# EasyEDA Pro project pcb.epro

# Board PCB1
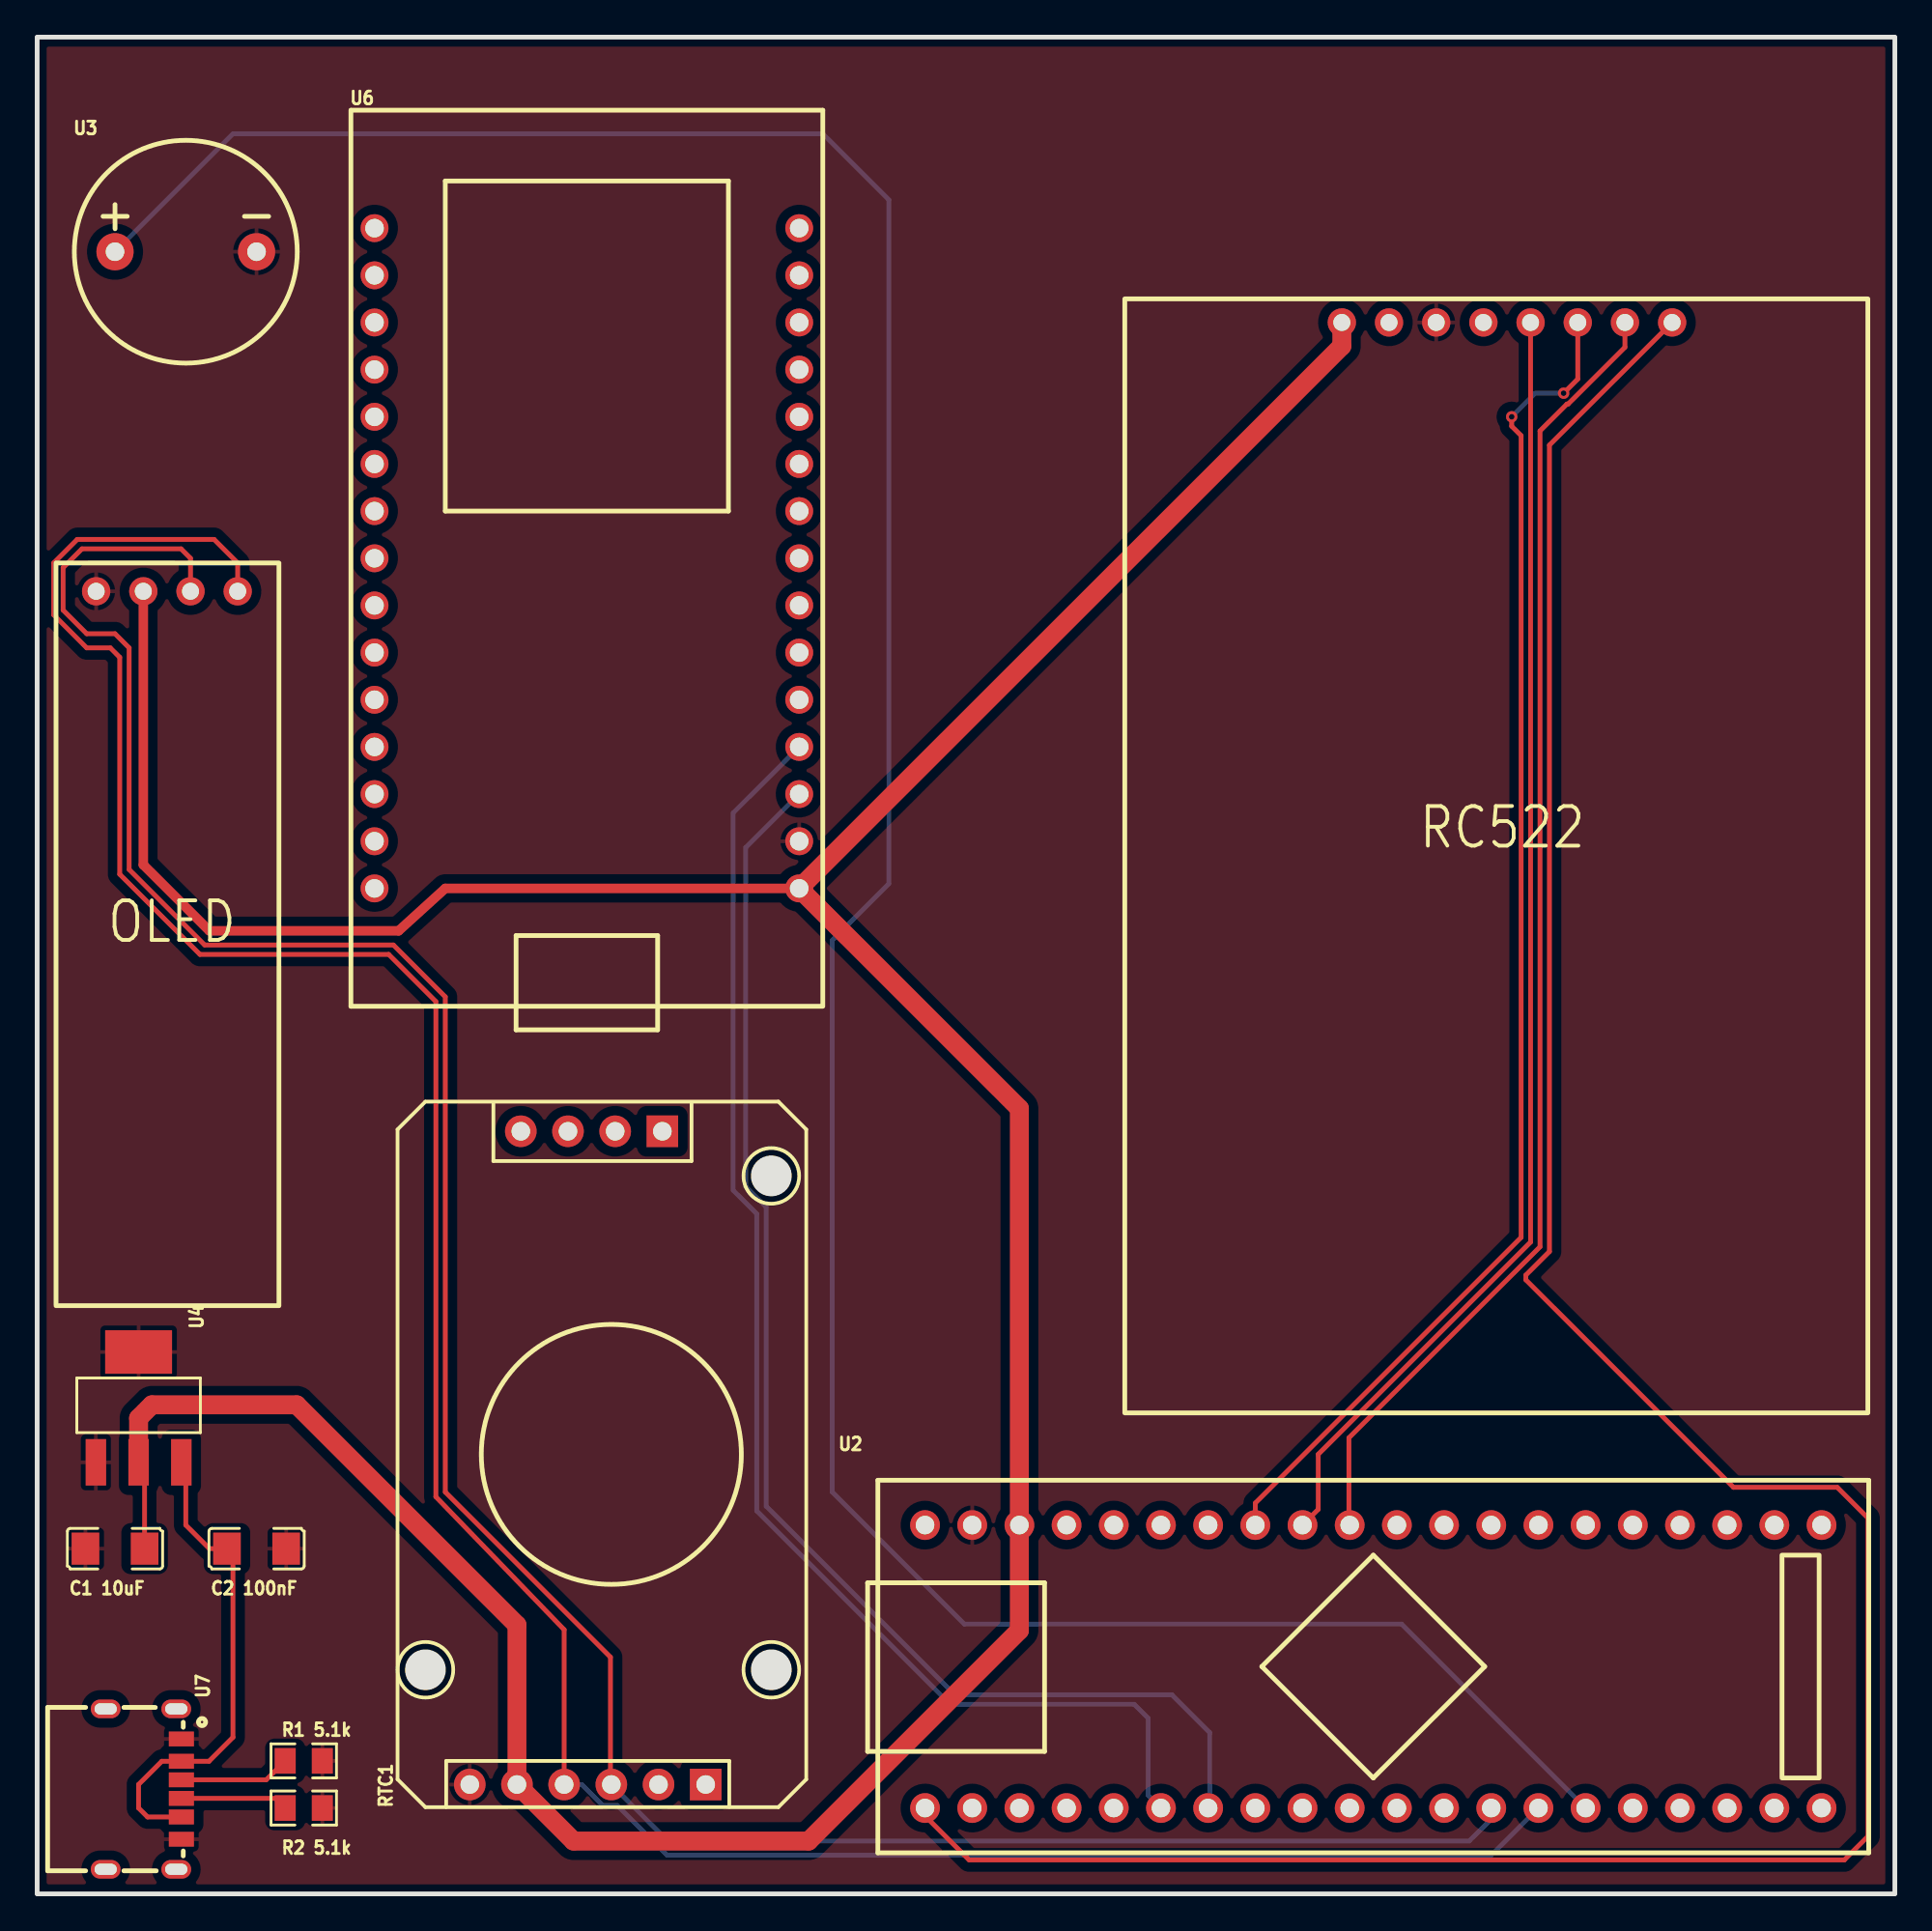
[diagram p0: board, top side]
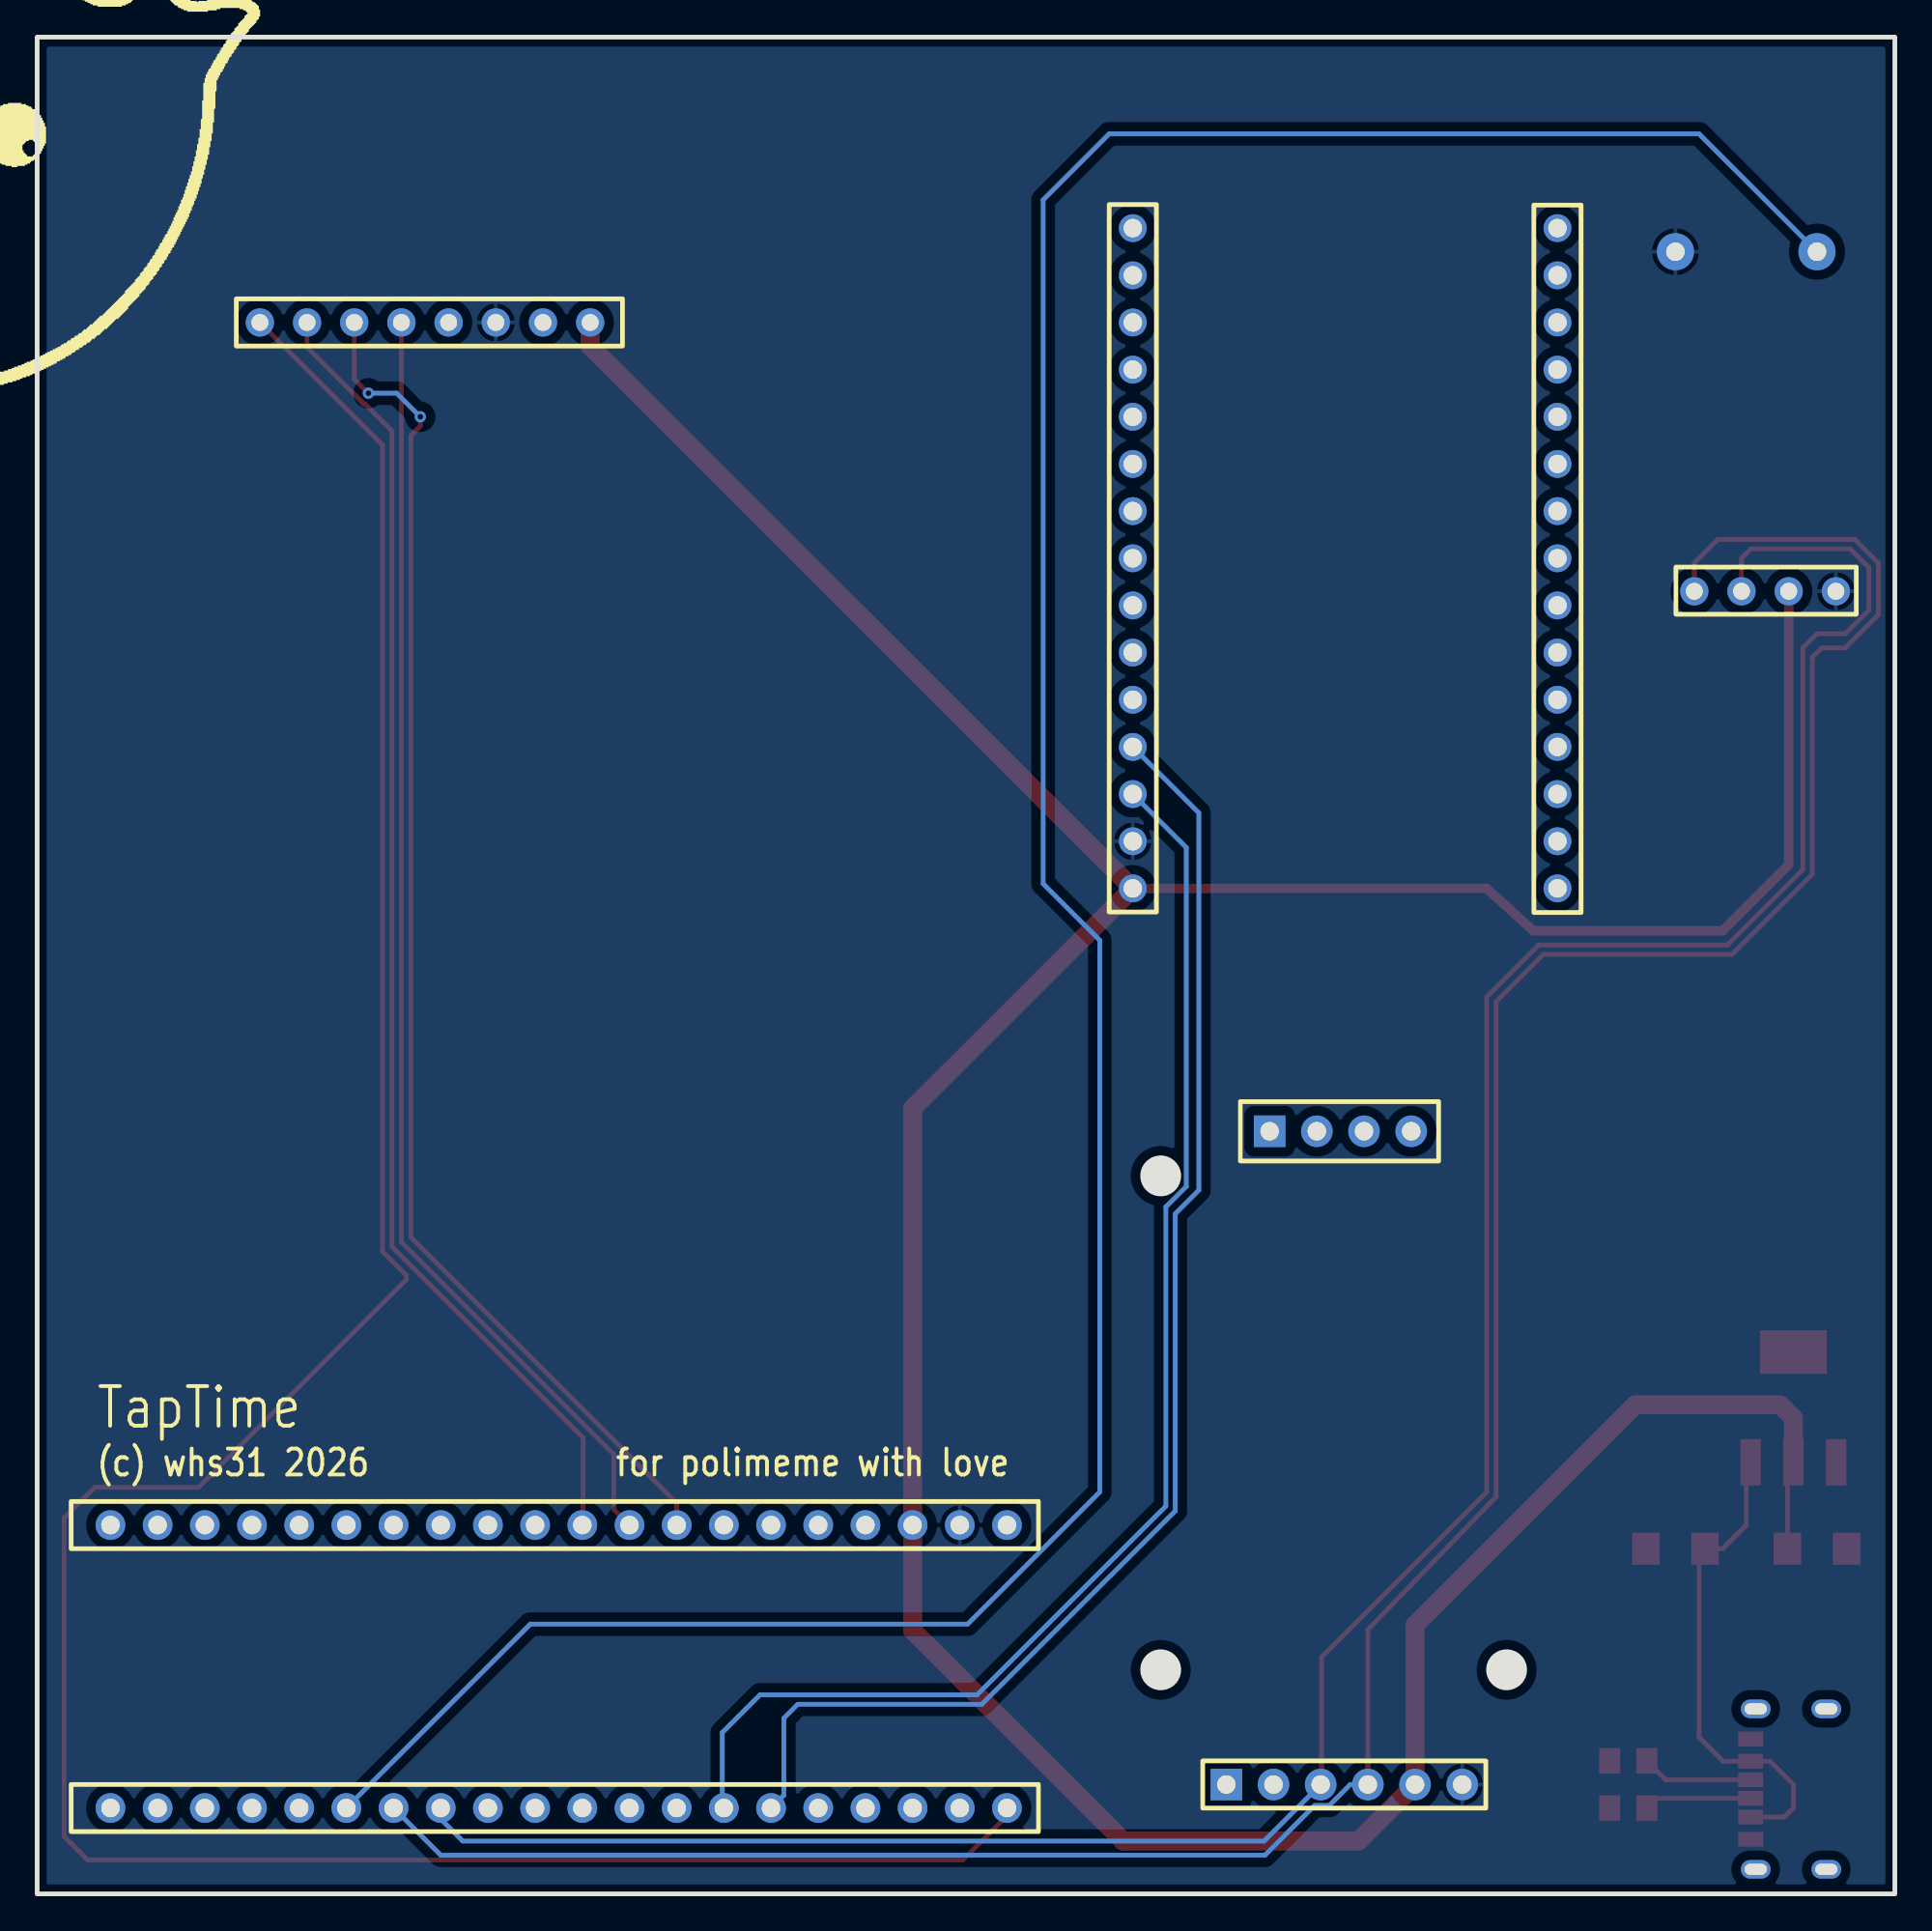
[diagram p1: board, bottom side, seen from below]

Outline 100 x 100 mm; copper layers: Top Layer, Bottom Layer. Coordinates in mm from the lower left corner of the outline.
Outline path: rectangle 0,100 100,0
Stack: Top Layer 0.035mm / Dielectric1 1.51mm FR4 er 4.5 / Bottom Layer 0.035mm

## Design rules (mm)
template: Custom Config
spacing copperThickness1oz (default): track to track 0.102, other pairs 0.152 to 0.3
spacing copperThickness2oz: track to track 0.203, other pairs 0.152 to 0.3
track width copperThickness1oz (default): min 0.127, default 0.254, max 2.54
track width copperThickness2oz: min 0.203, default 0.254, max 2.54
differential pair differentialPair (default): width min 0.127, default 0.254, max 2.54; gap min 0.152, default 0.152
via viaSize (default): diameter min 0.5, default 0.61, max 10; hole min 0.3, default 0.305, max 6.3

## Placement (name value [footprint] x y rotation side)
C1 10uF  10nF  [C1206]  4.19 18.59 180 top
C2 100nF  10nF  [C1206]  11.81 18.59 0 top
NOREF  -  [Pad_e53]  75.31 84.63 0 top
NOREF#2  -  [Pad_e56]  82.93 84.63 0 top
NOREF#3  -  [Pad_e54]  77.85 84.63 0 top
NOREF#4  -  [Pad_e31]  3.17 70.15 0 top
NOREF#5  -  [Pad_e32]  5.72 70.15 0 top
NOREF#6  -  [Pad_e51]  70.23 84.63 0 top
NOREF#7  -  [Pad_e52]  72.77 84.63 0 top
NOREF#8  -  [Pad_e58]  88.01 84.63 0 top
NOREF#9  -  [Pad_e34]  10.8 70.15 0 top
NOREF#10  -  [Pad_e57]  85.47 84.63 0 top
NOREF#11  -  [Pad_e55]  80.39 84.63 0 top
NOREF#12  -  [Pad_e33]  8.25 70.15 0 top
R1 5.1k  5.1kΩ  [R0805]  14.35 7.16 0 top
R2 5.1k  5.1kΩ  [R0805]  14.35 4.62 0 top
RTC1  DS3231  [DS3231 SOC]  29.59 23.67 90 top
U2  =STM32F411CEU6-Board  [STM32F411CEU6-Board]  72.77 12.24 0 top
U3  -  [KY-006]  8 88.44 0 top
U4  AMS1117-3.3  [SOT-223-3_L6.5-W3.4-P2.30-LS7.0-BR]  5.46 26.21 270 top
U6  -  [esp8266 nodemcu]  29.59 71.93 0 top
U7  TYPE-C 2.0 6PIN-L7.4  [USB-C-SMD_TYPE-C2.06PIN-L7.4]  5.73 5.64 270 top

## Footprints (pads in the part's own frame, mm; a bottom-side part is the same pattern mirrored in y, then rotated)
C1206
  rect 1.485x1.728 smd: 1(-1.593,0) 2(1.593,0)
DS3231 SOC
  rect 1.7x1.7 hole 1: 1(-17.784,-6.397) 7(17.399,-4.064)
  round 1.7 hole 1: 2(-17.784,-3.857) 3(-17.784,-1.317) 4(-17.784,1.223) 5(-17.784,3.763) 6(-17.784,6.303) 8(17.399,-1.524) 9(17.399,1.016) 10(17.399,3.556)
esp8266 nodemcu
  round 1.5 hole 1: 1(-11.43,17.78) 2(-11.43,15.24) 3(-11.43,12.7) 4(-11.43,10.16) 5(-11.43,7.62) 6(-11.43,5.08) 7(-11.43,2.54) 8(-11.43,0) 9(-11.43,-2.54) 10(-11.43,-5.08) 11(-11.43,-7.62) 12(-11.43,-10.16) 13(-11.43,-12.7) 14(-11.43,-15.24) 15(-11.43,-17.78) 16(11.43,-17.78) 17(11.43,-15.24) 18(11.43,-12.7) 19(11.43,-10.16) 20(11.43,-7.62) 21(11.43,-5.08) 22(11.43,-2.54) 23(11.43,0) 24(11.43,2.54) 25(11.43,5.08) 26(11.43,7.62) 27(11.43,10.16) 28(11.43,12.7) 29(11.43,15.24) 30(11.43,17.78)
KY-006
  round 2 hole 1: 1(-3.81,0) 2(3.81,0)
Pad_e31
  round 1.524 hole 0.914: 1(0,0)
Pad_e32
  round 1.524 hole 0.914: 2(0,0)
Pad_e33
  round 1.524 hole 0.914: 3(0,0)
Pad_e34
  round 1.524 hole 0.914: 4(0,0)
Pad_e51
  round 1.524 hole 0.914: 1(0,0)
Pad_e52
  round 1.524 hole 0.914: 2(0,0)
Pad_e53
  round 1.524 hole 0.914: 3(0,0)
Pad_e54
  round 1.524 hole 0.914: 4(0,0)
Pad_e55
  round 1.524 hole 0.914: 5(0,0)
Pad_e56
  round 1.524 hole 0.914: 6(0,0)
Pad_e57
  round 1.524 hole 0.914: 7(0,0)
Pad_e58
  round 1.524 hole 0.914: 8(0,0)
R0805
  rect 1.133x1.377 smd: 1(-1,0) 2(1,0)
SOT-223-3_L6.5-W3.4-P2.30-LS7.0-BR
  rect 2.5x1.1 smd: 1(2.97,-2.3) 2(2.97,0) 3(2.97,2.3)
  rect 2.34x3.6 smd: 4(-2.97,0)
STM32F411CEU6-Board
  round 1.6 hole 1: 1(-24.977,-7.62) 2(-22.436,-7.62) 3(-19.896,-7.62) 4(-17.357,-7.62) 5(-14.816,-7.62) 6(-12.277,-7.62) 7(-9.736,-7.62) 8(-7.197,-7.62) 9(-4.657,-7.62) 10(-2.116,-7.62) 11(0.423,-7.62) 12(2.963,-7.62) 13(5.503,-7.62) 14(8.043,-7.62) 15(10.584,-7.62) 16(13.123,-7.62) 17(15.664,-7.62) 18(18.203,-7.62) 19(20.744,-7.62) 20(23.284,-7.62) 21(23.284,7.62) 22(20.744,7.62) 23(18.203,7.62) 24(15.664,7.62) 25(13.123,7.62) 26(10.584,7.62) 27(8.043,7.62) 28(5.503,7.62) 29(2.963,7.62) 30(0.423,7.62) 31(-2.116,7.62) 32(-4.657,7.62) 33(-7.197,7.62) 34(-9.736,7.62) 35(-12.277,7.62) 36(-14.816,7.62) 37(-17.357,7.62) 38(-19.896,7.62) 39(-22.436,7.62) 40(-24.977,7.62)
USB-C-SMD_TYPE-C2.06PIN-L7.4
  oval 1x1.6 hole 0.6x1.2: 1(-4.32,1.762) 2(4.32,1.762) 3(-4.32,-2.038) 4(4.32,-2.038)
  rect 0.8x1.35 smd: A5(-0.499,2.038) A9(1.501,2.038) A12(2.701,2.038) B5(0.501,2.038) B9(-1.499,2.038) B12(-2.699,2.038)

## Nets
3V3: C1 10uF.1 NOREF#5.2 NOREF#6.1 RTC1.5 U2.38 U4.2 U6.16
GND: C1 10uF.2 C2 100nF.2 NOREF.3 NOREF#4.1 R1 5.1k.2 R2 5.1k.2 RTC1.6 U2.39 U3.2 U4.1 U4.4 U6.17 U7.A12 U7.B12
VIN1: C2 100nF.1 U4.3 U7.A9 U7.B9
A5: R1 5.1k.1 U7.A5
B5: R2 5.1k.1 U7.B5
BUZSIG: U2.15 U3.1
I2CSCK: NOREF#12.3 RTC1.3 U2.13
I2CSDA: NOREF#9.4 RTC1.4 U2.14
SPIMISO: NOREF#11.5 U2.32
SPIMOSI: NOREF#2.6 U2.33
SPISCK: NOREF#10.7 U2.31
SPISDA: NOREF#8.8 U2.1
UART_RX: U2.6 U6.19
UART_TX: U2.7 U6.18

Pads without a net: NOREF#3 4; NOREF#7 2; RTC1 1 2 7 8 9 10; U2 2 3 4 5 8 9 10 11 12 16 17 18 19 20 21 22 23 24 25 26 27 28 29 30 34 35 36 37 40; U6 1 2 3 4 5 6 7 8 9 10 11 12 13 14 15 20 21 22 23 24 25 26 27 28 29 30; U7 1 2 3 4

## Via types
v1: diameter 0.61, hole 0.305, Top Layer to Bottom Layer, 2 vias

## Routing (per net, layer and track width the routed paths; a pad name or vN(x,y) marks a point on that pad's centre or on a via; arc(x,y) is an arc through that point)
3V3: length 214.2
  Top Layer w0.254: C1 10uF.1 5.78,22.92 U4.2
  Top Layer w0.508: NOREF#5.2 5.72,55.42 9.27,51.87 19.46,51.87 21.97,54.15 U6.16
  Top Layer w1.016: U4.2 5.46,25.62 6.18,26.34 13.97,26.34 25.83,14.48 RTC1.5 28.87,2.84 41.53,2.84 52.87,14.19 U2.38 52.87,42.3 U6.16 70.23,83.36 NOREF#6.1
VIN1: length 26.4
  Top Layer w0.254: U4.3 8,23 8,19.86 9.27,18.59 C2 100nF.1 10.54,18.27 10.54,8.43 9.25,7.14 U7.B9 6.71,7.14 5.46,5.89 5.46,4.62 5.94,4.14 U7.A9
A5: length 6
  Top Layer w0.254: R1 5.1k.1 12.33,6.14 U7.A5
B5: length 5.8
  Top Layer w0.254: U7.B5 12.83,5.14 R2 5.1k.1
BUZSIG: length 164.2
  Bottom Layer w0.254: U3.1 10.54,94.79 42.29,94.79 45.85,91.24 45.85,54.41 42.8,51.36 42.8,21.64 49.91,14.53 73.45,14.53 U2.15
I2CSCK: length 143.6
  Top Layer w0.254: RTC1.3 30.86,5.94 30.86,12.75 21.97,21.64 21.97,48.31 19.18,51.1 9.02,51.1 4.95,55.17 4.95,67.11 4.19,67.87 2.67,67.87 1.4,69.14 1.4,71.42 2.41,72.44 7.75,72.44 8.25,71.93 NOREF#12.3
  Bottom Layer w0.254: RTC1.3 33.95,2.84 77.09,2.84 78.27,4.03 U2.13
I2CSDA: length 151.4
  Top Layer w0.254: RTC1.4 28.37,14.23 21.46,21.39 21.46,48.06 18.92,50.6 8.76,50.6 4.45,54.91 4.45,66.6 3.94,67.11 2.67,67.11 0.89,68.88 0.89,71.68 2.16,72.95 9.53,72.95 10.8,71.68 NOREF#9.4
  Bottom Layer w0.254: U2.14 78.27,2.08 33.91,2.08 31.23,4.76 30.44,4.76 29.31,5.89 RTC1.4
SPIMISO: length 69.9
  Top Layer w0.254: U2.32 68.96,20.71 68.96,23.67 80.39,35.1 NOREF#11.5
SPIMOSI: length 73.3
  Top Layer w0.254: v1(82.17,80.82) 82.93,81.58 NOREF#2.6 ; U2.33 65.57,21.05 79.88,35.36 79.88,78.54 79.38,79.04 v1(79.38,79.55)
  Bottom Layer w0.254: v1(82.17,80.82) 80.65,80.82 v1(79.38,79.55)
SPISCK: length 71
  Top Layer w0.254: NOREF#10.7 85.47,83.3 82.41,80.24 82.35,80.24 80.9,78.79 80.9,34.85 70.61,24.56 70.61,19.91 U2.31
SPISDA: length 148.4
  Top Layer w0.254: U2.1 47.79,4.2 50.16,1.83 97.28,1.83 98.55,3.1 98.55,20.24 96.9,21.89 91.31,21.89 80.14,33.07 80.14,33.32 81.41,34.59 81.41,78.03 NOREF#8.8
UART_RX: length 74
  Bottom Layer w0.254: U2.6 59.81,5.31 59.81,9.46 59.06,10.21 49.15,10.21 38.74,20.62 38.74,36.63 37.47,37.9 37.47,58.22 U6.19
UART_TX: length 73
  Bottom Layer w0.254: U2.7 63.12,4.71 63.12,8.69 61.09,10.72 49.4,10.72 39.24,20.88 39.24,37 38.14,38.1 38.14,56.35 U6.18

## Copper pours and planes (outline as drawn; the poured copper is in the pictures)
GND on Top Layer: -3.43,107.49 101.98,107.49 101.98,-4.27 -3.43,-4.27
GND on Bottom Layer: -3.68,104.7 107.57,104.7 107.57,-9.86 -3.68,-9.86

## Text on the board
Bottom Silkscreen Layer: for polimeme with love | (c) whs31 2026 | TapTime
Top Silkscreen Layer: OLED | RC522
